# Altium schematic sheet Valve.SchDoc
size A3
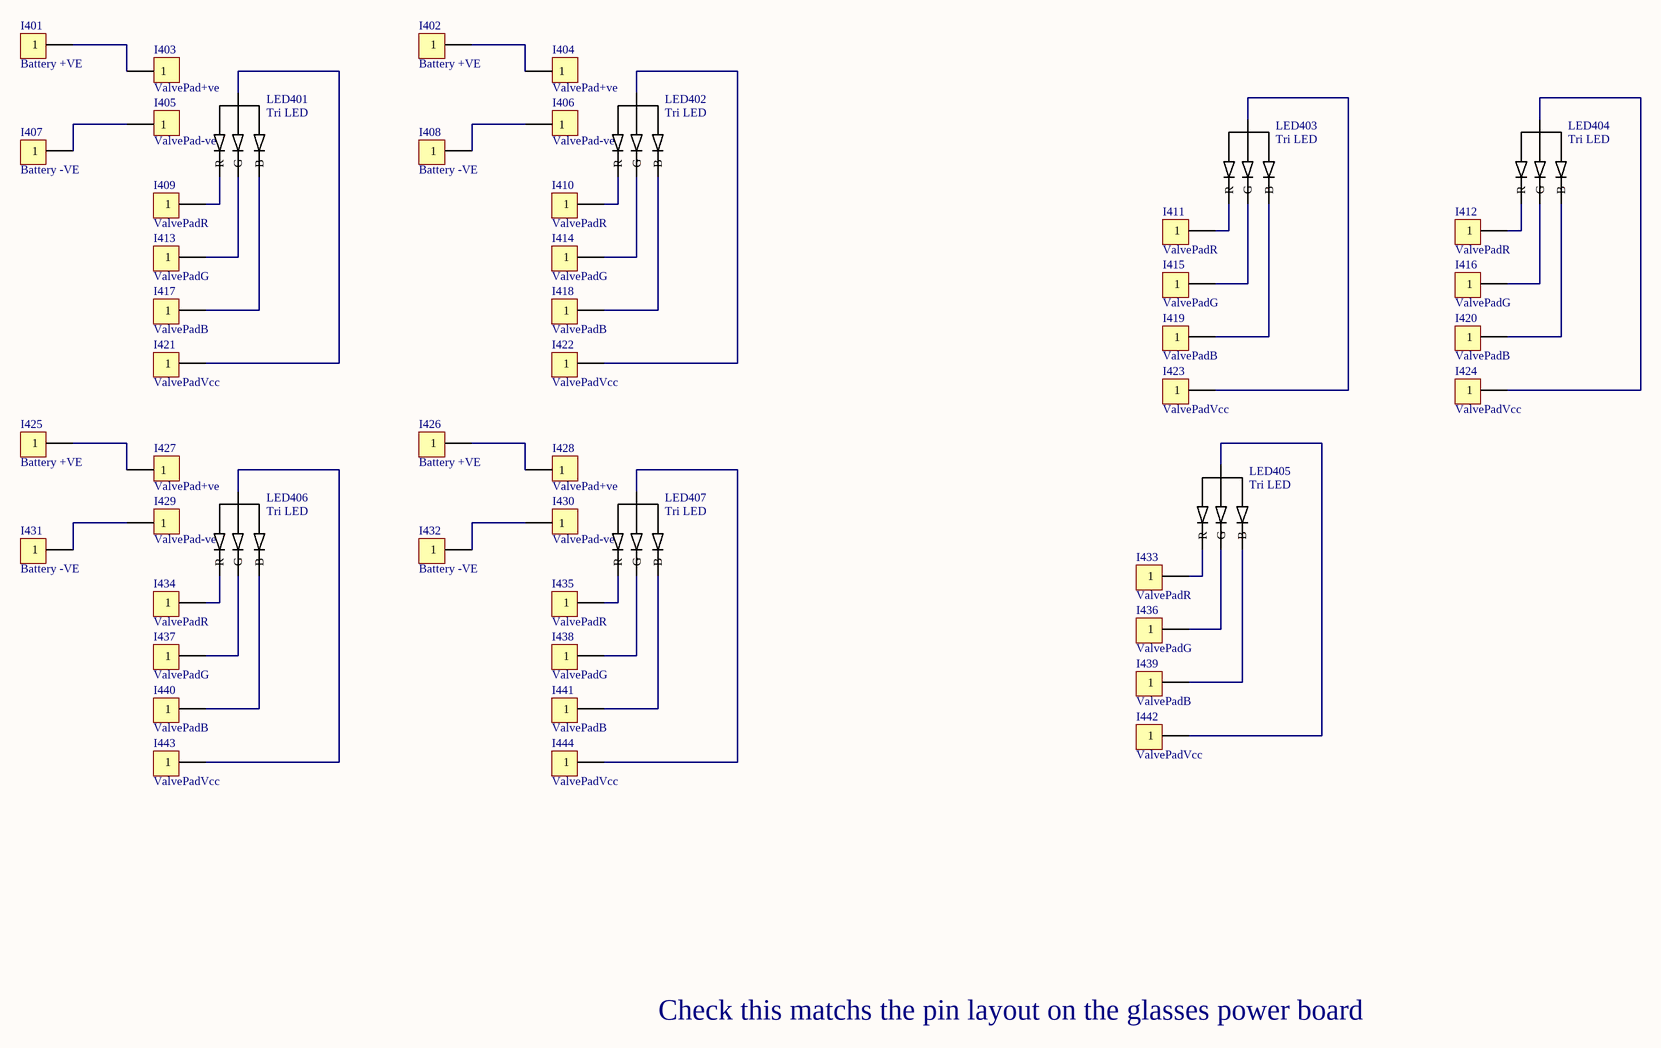
[diagram p0: Valve.SchDoc]

## Parts
I401  Battery +VE  [ValveBattery+VE]
I402  Battery +VE  [ValveBattery+VE]
I403  ValvePad+ve  [TestPoint]
I404  ValvePad+ve  [TestPoint]
I405  ValvePad-ve  [TestPoint]
I406  ValvePad-ve  [TestPoint]
I407  Battery -VE  [ValveBattery-VE]
I408  Battery -VE  [ValveBattery-VE]
I409  ValvePadR  [TestPoint]
I410  ValvePadR  [TestPoint]
I411  ValvePadR  [TestPoint]
I412  ValvePadR  [TestPoint]
I413  ValvePadG  [TestPoint]
I414  ValvePadG  [TestPoint]
I415  ValvePadG  [TestPoint]
I416  ValvePadG  [TestPoint]
I417  ValvePadB  [TestPoint]
I418  ValvePadB  [TestPoint]
I419  ValvePadB  [TestPoint]
I420  ValvePadB  [TestPoint]
I421  ValvePadVcc  [TestPoint]
I422  ValvePadVcc  [TestPoint]
I423  ValvePadVcc  [TestPoint]
I424  ValvePadVcc  [TestPoint]
I425  Battery +VE  [ValveBattery+VE]
I426  Battery +VE  [ValveBattery+VE]
I427  ValvePad+ve  [TestPoint]
I428  ValvePad+ve  [TestPoint]
I429  ValvePad-ve  [TestPoint]
I430  ValvePad-ve  [TestPoint]
I431  Battery -VE  [ValveBattery-VE]
I432  Battery -VE  [ValveBattery-VE]
I433  ValvePadR  [TestPoint]
I434  ValvePadR  [TestPoint]
I435  ValvePadR  [TestPoint]
I436  ValvePadG  [TestPoint]
I437  ValvePadG  [TestPoint]
I438  ValvePadG  [TestPoint]
I439  ValvePadB  [TestPoint]
I440  ValvePadB  [TestPoint]
I441  ValvePadB  [TestPoint]
I442  ValvePadVcc  [TestPoint]
I443  ValvePadVcc  [TestPoint]
I444  ValvePadVcc  [TestPoint]
LED401  Tri LED  [CLV1A-FKB]
LED402  Tri LED  [CLV1A-FKB]
LED403  Tri LED  [CLV1A-FKB]
LED404  Tri LED  [CLV1A-FKB]
LED405  Tri LED  [CLV1A-FKB]
LED406  Tri LED  [CLV1A-FKB]
LED407  Tri LED  [CLV1A-FKB]

## Nets
NetI401_1: I401.1 I403.1
NetI402_1: I402.1 I404.1
NetI405_1: I405.1 I407.1
NetI406_1: I406.1 I408.1
NetI409_1: I409.1 LED401.1(R)
NetI410_1: I410.1 LED402.1(R)
NetI411_1: I411.1 LED403.1(R)
NetI412_1: I412.1 LED404.1(R)
NetI413_1: I413.1 LED401.4(G)
NetI414_1: I414.1 LED402.4(G)
NetI415_1: I415.1 LED403.4(G)
NetI416_1: I416.1 LED404.4(G)
NetI417_1: I417.1 LED401.3(B)
NetI418_1: I418.1 LED402.3(B)
NetI419_1: I419.1 LED403.3(B)
NetI420_1: I420.1 LED404.3(B)
NetI421_1: I421.1 LED401.2(Common)
NetI422_1: I422.1 LED402.2(Common)
NetI423_1: I423.1 LED403.2(Common)
NetI424_1: I424.1 LED404.2(Common)
NetI425_1: I425.1 I427.1
NetI426_1: I426.1 I428.1
NetI429_1: I429.1 I431.1
NetI430_1: I430.1 I432.1
NetI433_1: I433.1 LED405.1(R)
NetI434_1: I434.1 LED406.1(R)
NetI435_1: I435.1 LED407.1(R)
NetI436_1: I436.1 LED405.4(G)
NetI437_1: I437.1 LED406.4(G)
NetI438_1: I438.1 LED407.4(G)
NetI439_1: I439.1 LED405.3(B)
NetI440_1: I440.1 LED406.3(B)
NetI441_1: I441.1 LED407.3(B)
NetI442_1: I442.1 LED405.2(Common)
NetI443_1: I443.1 LED406.2(Common)
NetI444_1: I444.1 LED407.2(Common)

## Notes on the sheet
- Check this matchs the pin layout on the glasses power board

## Library data of the parts
I401-I444 = TestPoint